# EAGLE schematic 1616 (EAGLE 9.4.2)
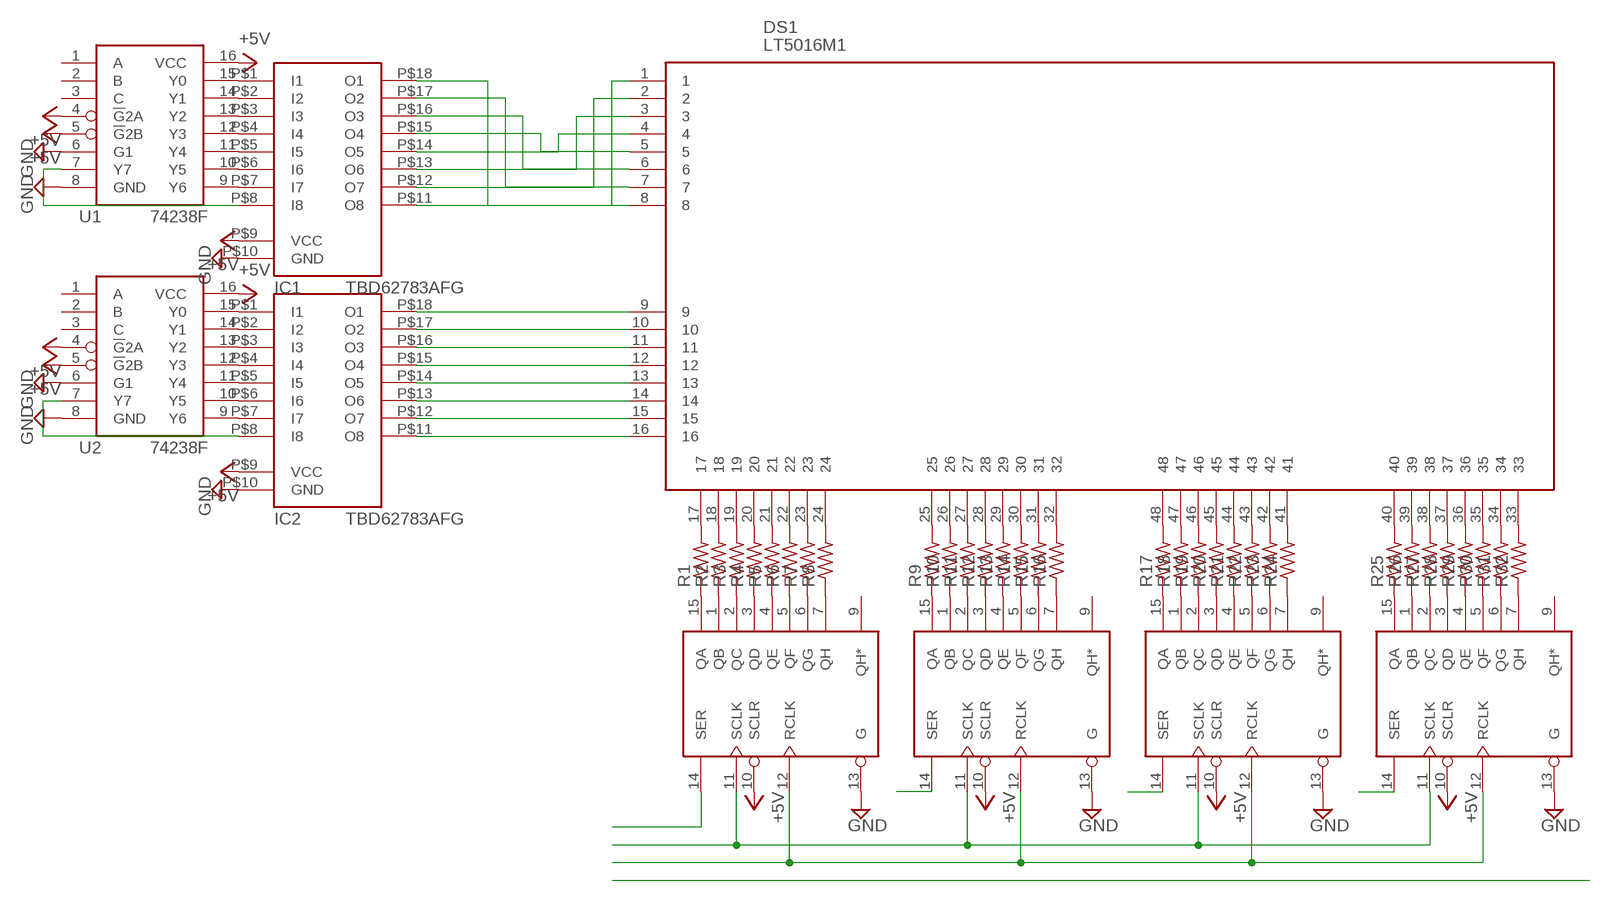
[diagram p0: schematic, sheet 1]

## Parts
DS1  LT5016M1  [LT5016M1]
IC1  TBD62783AFG  [SOP18]
IC2  TBD62783AFG  [SOP18]
R1  R-2012  [2012-R]
R2  R-2012  [2012-R]
R3  R-2012  [2012-R]
R4  R-2012  [2012-R]
R5  R-2012  [2012-R]
R6  R-2012  [2012-R]
R7  R-2012  [2012-R]
R8  R-2012  [2012-R]
R9  R-2012  [2012-R]
R10  R-2012  [2012-R]
R11  R-2012  [2012-R]
R12  R-2012  [2012-R]
R13  R-2012  [2012-R]
R14  R-2012  [2012-R]
R15  R-2012  [2012-R]
R16  R-2012  [2012-R]
R17  R-2012  [2012-R]
R18  R-2012  [2012-R]
R19  R-2012  [2012-R]
R20  R-2012  [2012-R]
R21  R-2012  [2012-R]
R22  R-2012  [2012-R]
R23  R-2012  [2012-R]
R24  R-2012  [2012-R]
R25  R-2012  [2012-R]
R26  R-2012  [2012-R]
R27  R-2012  [2012-R]
R28  R-2012  [2012-R]
R29  R-2012  [2012-R]
R30  R-2012  [2012-R]
R31  R-2012  [2012-R]
R32  R-2012  [2012-R]
U1  74238F  [SOP16]
U2  74238F  [SOP16]
U$1  74HC595N  [DIL16]
U$2  74HC595N  [DIL16]
U$3  74HC595N  [DIL16]
U$4  74HC595N  [DIL16]

## Nets
+5V: IC1.P$9(VCC) IC2.P$9(VCC) U1.4(!G!2A) U1.5(!G!2B) U1.16(VCC) U2.4(!G!2A) U2.5(!G!2B) U2.16(VCC) U$1.10(SCLR) U$2.10(SCLR) U$3.10(SCLR) U$4.10(SCLR)
GND: IC1.P$10(GND) IC2.P$10(GND) U1.6(G1) U1.8(GND) U2.6(G1) U2.8(GND) U$1.13(G) U$2.13(G) U$3.13(G) U$4.13(G)
N$1: DS1.24 R8.2
N$2: DS1.25 R9.2
N$3: DS1.26 R10.2
N$4: DS1.17 R1.2
N$5: DS1.18 R2.2
N$6: DS1.19 R3.2
N$7: DS1.20 R4.2
N$8: DS1.21 R5.2
N$9: DS1.22 R6.2
N$10: DS1.23 R7.2
N$11: DS1.27 R11.2
N$12: DS1.28 R12.2
N$13: DS1.29 R13.2
N$14: DS1.30 R14.2
N$15: DS1.31 R15.2
N$16: DS1.32 R16.2
N$17: DS1.48 R17.2
N$18: DS1.47 R18.2
N$19: DS1.46 R19.2
N$20: DS1.45 R20.2
N$21: DS1.44 R21.2
N$22: DS1.43 R22.2
N$23: DS1.42 R23.2
N$24: DS1.41 R24.2
N$25: DS1.40 R25.2
N$26: DS1.39 R26.2
N$27: DS1.38 R27.2
N$28: DS1.37 R28.2
N$29: DS1.36 R29.2
N$30: DS1.35 R30.2
N$31: DS1.34 R31.2
N$32: DS1.33 R32.2
N$33: U$2.14(SER)
N$34: U$1.14(SER)
N$35: U$4.14(SER)
N$37: DS1.1 IC1.P$11(O8)
N$38: U$1.11(SCLK) U$2.11(SCLK) U$3.11(SCLK) U$4.11(SCLK)
N$39: U$1.12(RCLK) U$2.12(RCLK) U$3.12(RCLK) U$4.12(RCLK)
N$40: U$3.14(SER)
N$41: DS1.2 IC1.P$12(O7)
N$42: DS1.3 IC1.P$13(O6)
N$43: DS1.4 IC1.P$14(O5)
N$44: DS1.5 IC1.P$15(O4)
N$45: DS1.6 IC1.P$16(O3)
N$46: DS1.7 IC1.P$17(O2)
N$47: DS1.8 IC1.P$18(O1)
N$48: DS1.9 IC2.P$18(O1)
N$49: DS1.10 IC2.P$17(O2)
N$50: DS1.11 IC2.P$16(O3)
N$51: DS1.12 IC2.P$15(O4)
N$52: DS1.13 IC2.P$14(O5)
N$53: DS1.14 IC2.P$13(O6)
N$54: DS1.15 IC2.P$12(O7)
N$55: DS1.16 IC2.P$11(O8)
N$56: IC1.P$7(I7) U1.9(Y6)
N$57: IC1.P$6(I6) U1.10(Y5)
N$58: IC1.P$5(I5) U1.11(Y4)
N$59: IC1.P$4(I4) U1.12(Y3)
N$60: IC1.P$3(I3) U1.13(Y2)
N$61: IC1.P$2(I2) U1.14(Y1)
N$62: IC1.P$1(I1) U1.15(Y0)
N$63: IC2.P$7(I7) U2.9(Y6)
N$64: IC2.P$6(I6) U2.10(Y5)
N$65: IC2.P$5(I5) U2.11(Y4)
N$66: IC2.P$4(I4) U2.12(Y3)
N$67: IC2.P$3(I3) U2.13(Y2)
N$68: IC2.P$2(I2) U2.14(Y1)
N$69: IC2.P$1(I1) U2.15(Y0)
N$70: R1.1 U$1.15(QA)
N$71: R2.1 U$1.1(QB)
N$72: R3.1 U$1.2(QC)
N$73: R4.1 U$1.3(QD)
N$74: R5.1 U$1.4(QE)
N$75: R6.1 U$1.5(QF)
N$76: R7.1 U$1.6(QG)
N$77: R8.1 U$1.7(QH)
N$78: R9.1 U$2.15(QA)
N$79: R10.1 U$2.1(QB)
N$80: R11.1 U$2.2(QC)
N$81: R12.1 U$2.3(QD)
N$82: R13.1 U$2.4(QE)
N$83: R14.1 U$2.5(QF)
N$84: R15.1 U$2.6(QG)
N$85: R16.1 U$2.7(QH)
N$86: R17.1 U$3.15(QA)
N$87: R18.1 U$3.1(QB)
N$88: R19.1 U$3.2(QC)
N$89: R20.1 U$3.3(QD)
N$90: R21.1 U$3.4(QE)
N$91: R22.1 U$3.5(QF)
N$92: R23.1 U$3.6(QG)
N$93: R24.1 U$3.7(QH)
N$94: R25.1 U$4.15(QA)
N$95: R26.1 U$4.1(QB)
N$96: R27.1 U$4.2(QC)
N$97: R28.1 U$4.3(QD)
N$98: R29.1 U$4.4(QE)
N$99: R30.1 U$4.5(QF)
N$100: R31.1 U$4.6(QG)
N$101: R32.1 U$4.7(QH)
N$102: IC2.P$8(I8) U2.7(Y7)
N$103: IC1.P$8(I8) U1.7(Y7)
Unconnected: U1.1(A) U1.2(B) U1.3(C) U2.1(A) U2.2(B) U2.3(C) U$1.9(QH*) U$2.9(QH*) U$3.9(QH*) U$4.9(QH*)

## Power pins joined to a net without a drawn wire
GND: U$1.8(GND) U$2.8(GND) U$3.8(GND) U$4.8(GND)
VCC: U$1.16(VCC) U$2.16(VCC) U$3.16(VCC) U$4.16(VCC)

## Library data of the parts
DS1 = LT5016M1:LT5016M1: 16 x 16 dot matrix BIG 2 color LED LT - 5016 M 1 Source: Datasheet <http://akizukidenshi.com/catalog/g/gI-00039/>; DESCRIPTION: 16 x 16 dot matrix BIG 2 color LED LT - 5016 M 1; HEIGHT: 11mm; MANUFACTURER_NAME: Sharp Microelectronics; MANUFACTURER_PART_NUMBER: LT5016M1
IC1 IC2 = Transistor_Robotech:TBD62783A
R1-R32 = Passive_Robotech:R
U1 U2 = IC_Robotech:74*238
U$1-U$4 = IC_Robotech:74*595

## Net classes
0 default: width 0.406 mm